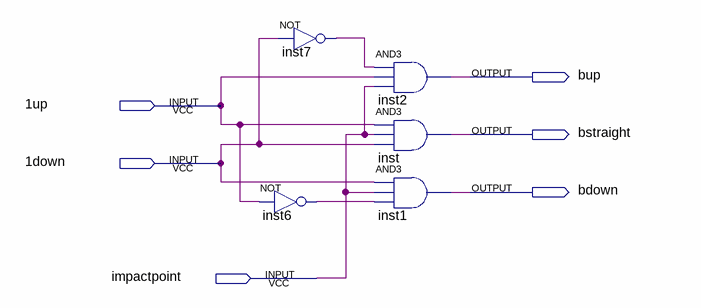
[diagram p0: schematic sheet]
// Quartus schematic insidebounce.bdf as structural Verilog: 5 symbols, 6 pins
module insidebounce (
  input  \1up ,
  input  \1down ,
  input  impactpoint,
  output bup,
  output bstraight,
  output bdown
);

  wire inst6_out, inst7_out;

  not inst7 (inst7_out, \1down );
  not inst6 (inst6_out, \1up );
  and inst2 (bup, inst7_out, \1up , impactpoint);
  and inst (bstraight, \1up , impactpoint, \1down );
  and inst1 (bdown, \1down , impactpoint, inst6_out);
endmodule
